# Altium schematic sheet Page1.SchDoc
size A3; SheetNumber: 1
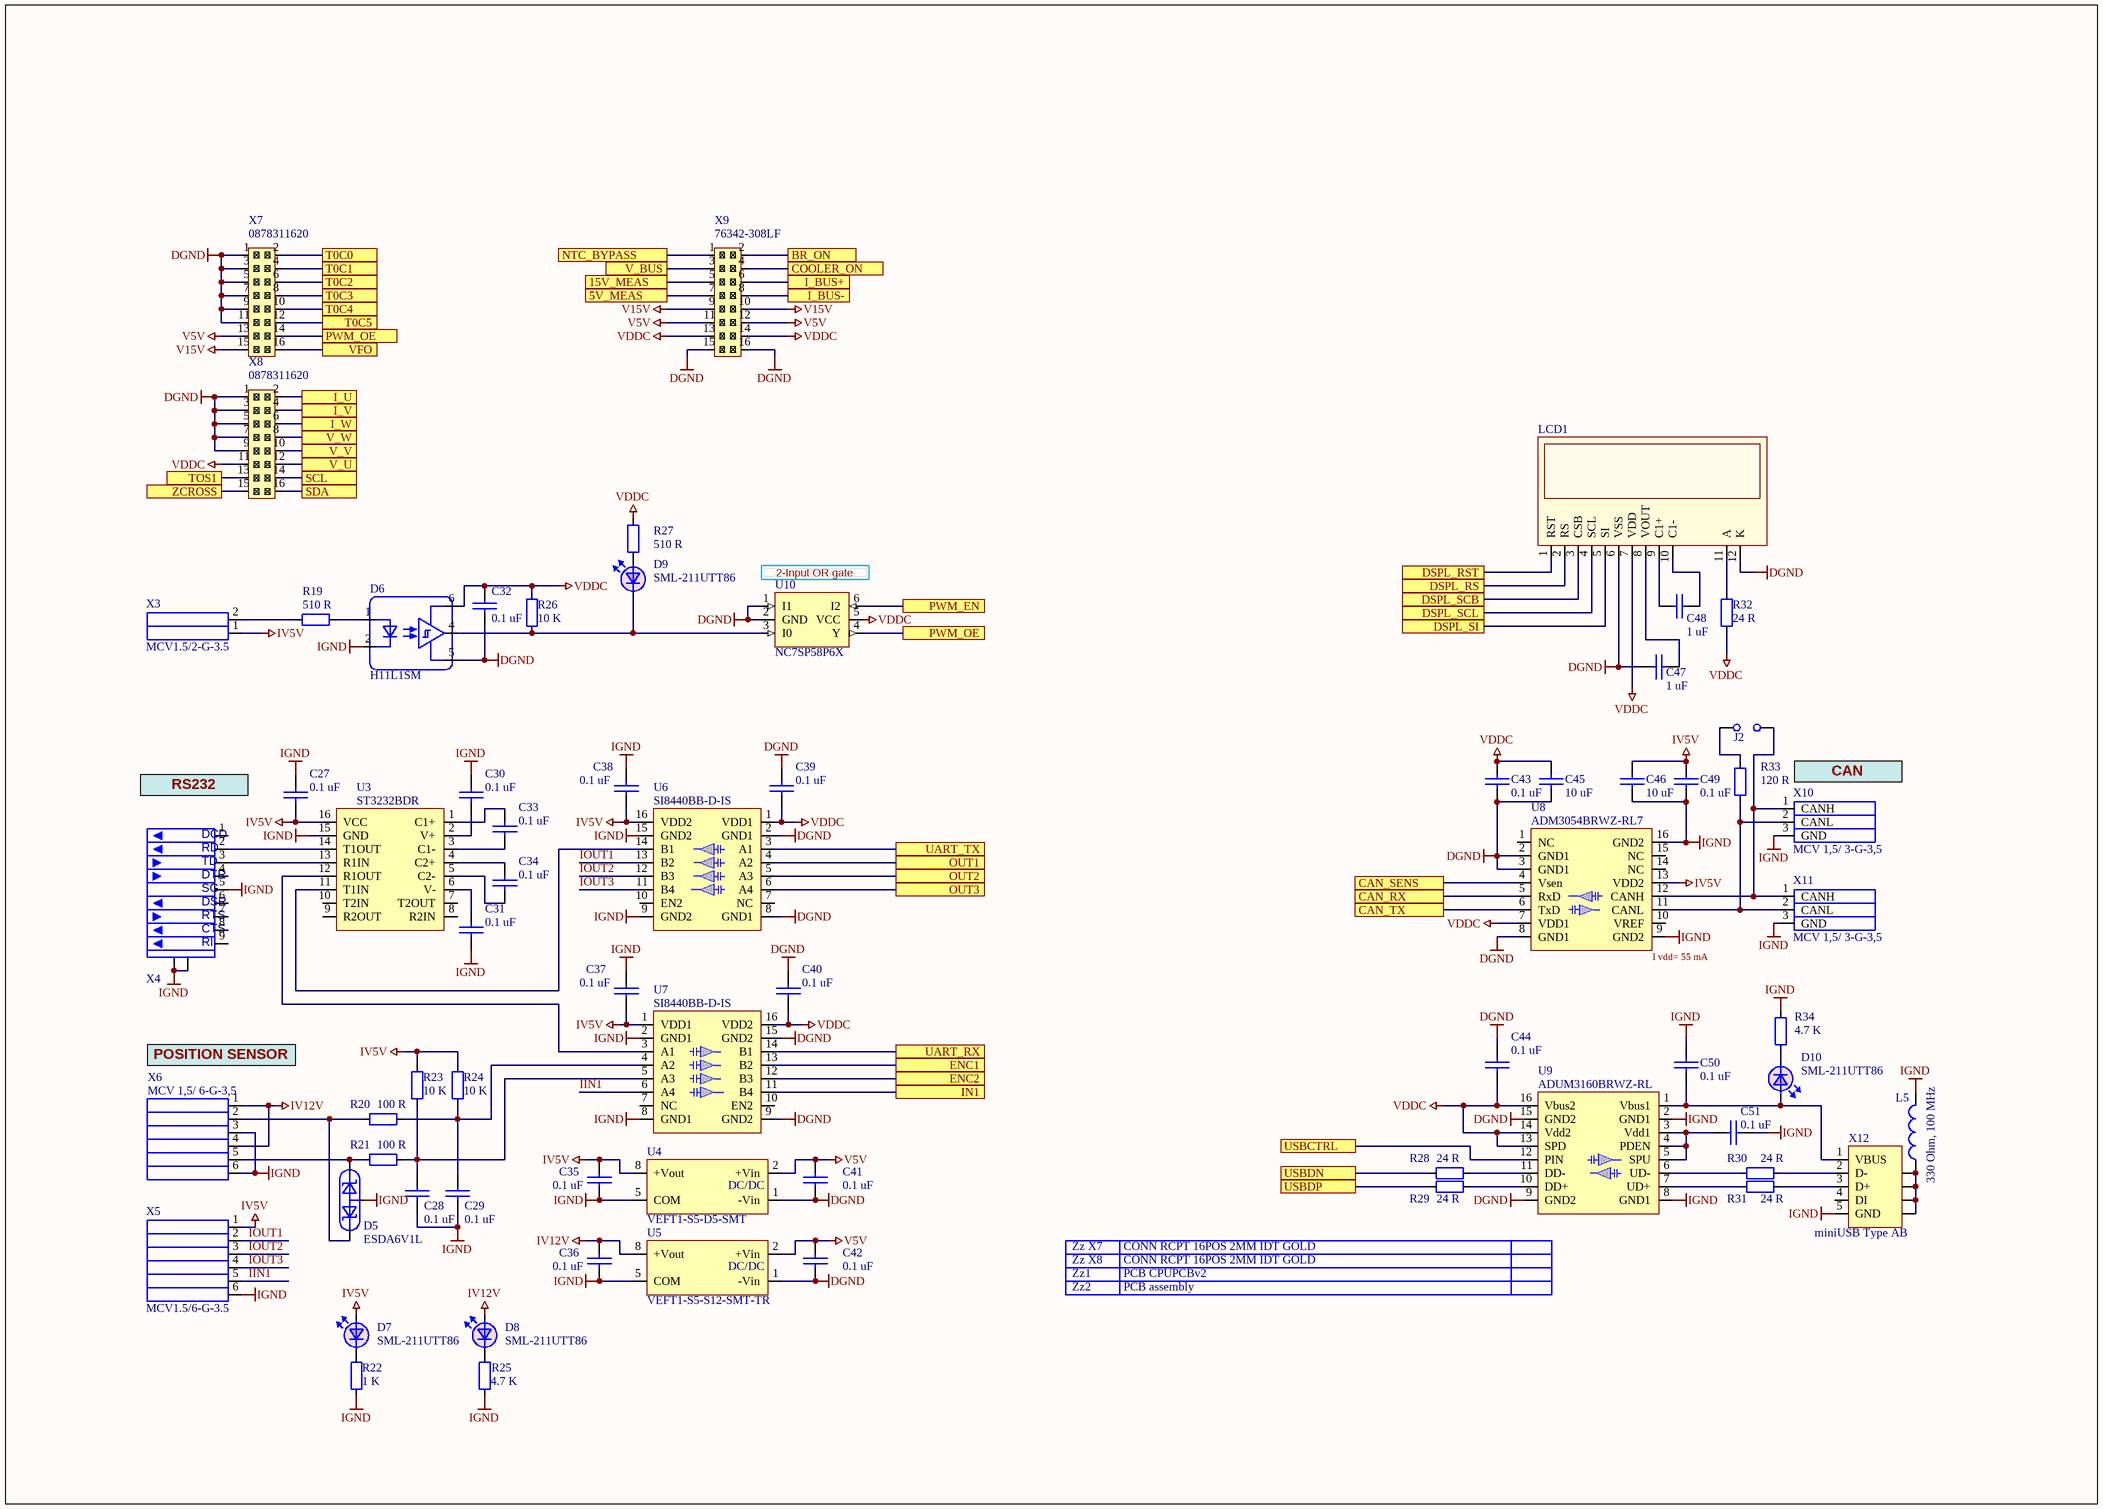
[diagram p0: Page1.SchDoc]

## Parts
C27  value 0.1 uF  [1608[0603]]  (hidden comment: CL10B104KA8NNND)
C28  value 0.1 uF  [1608[0603]]  (hidden comment: CL10B104KA8NNND)
C29  value 0.1 uF  [1608[0603]]  (hidden comment: CL10B104KA8NNND)
C30  value 0.1 uF  [1608[0603]]  (hidden comment: CL10B104KA8NNND)
C31  value 0.1 uF  [1608[0603]]  (hidden comment: CL10B104KA8NNND)
C32  value 0.1 uF  [1608[0603]]  (hidden comment: CL10B104KA8NNND)
C33  value 0.1 uF  [1608[0603]]  (hidden comment: CL10B104KA8NNND)
C34  value 0.1 uF  [1608[0603]]  (hidden comment: CL10B104KA8NNND)
C35  value 0.1 uF  [1608[0603]]  (hidden comment: CL10B104KA8NNND)
C36  value 0.1 uF  [1608[0603]]  (hidden comment: CL10B104KA8NNND)
C37  value 0.1 uF  [1608[0603]]  (hidden comment: CL10B104KA8NNND)
C38  value 0.1 uF  [1608[0603]]  (hidden comment: CL10B104KA8NNND)
C39  value 0.1 uF  [1608[0603]]  (hidden comment: CL10B104KA8NNND)
C40  value 0.1 uF  [1608[0603]]  (hidden comment: CL10B104KA8NNND)
C41  value 0.1 uF  [1608[0603]]  (hidden comment: CL10B104KA8NNND)
C42  value 0.1 uF  [1608[0603]]  (hidden comment: CL10B104KA8NNND)
C43  value 0.1 uF  [1608[0603]]  (hidden comment: CL10B104KA8NNND)
C44  value 0.1 uF  [1608[0603]]  (hidden comment: CL10B104KA8NNND)
C45  value 10 uF  [2012[0805]]  (hidden comment: C2012X5R1C106K085AC)
C46  value 10 uF  [2012[0805]]  (hidden comment: C2012X5R1C106K085AC)
C47  value 1 uF  [2012[0805]]  (hidden comment: CVUF001K0805)
C48  value 1 uF  [2012[0805]]  (hidden comment: CVUF001K0805)
C49  value 0.1 uF  [1608[0603]]  (hidden comment: CL10B104KA8NNND)
C50  value 0.1 uF  [1608[0603]]  (hidden comment: CL10B104KA8NNND)
C51  value 0.1 uF  [1608[0603]]  (hidden comment: CL10B104KA8NNND)
D5  ESDA6V1L  [SOT23]
D6  H11L1SM  [DIP-6 SMD]
D7  SML-211UTT86  [0805 LED]
D8  SML-211UTT86  [0805 LED]
D9  SML-211UTT86  [0805 LED]
D10  SML-211UTT86  [0805 LED]
J2  PH1-02-TA-HT  [HDR1X2V]  (value not drawn)
L5  value 330 Ohm, 100 MHz  [0603]  (hidden comment: BLM18SG331TN1D)
LCD1  NHD-C0216CZ-FSW-FBW-3V3  [Display NHD-C0216CZ-FSW-FBW-3V3]  (value not drawn)
R19  value 510 R  [0603]  (hidden comment: CRCW0603510RFKEA)
R20  value 100 R  [0603]  (hidden comment: ERJ-3EKF1000V)
R21  value 100 R  [0603]  (hidden comment: ERJ-3EKF1000V)
R22  value 1 K  [0603]  (hidden comment: RC0603FR-071KL)
R23  value 10 K  [0603]  (hidden comment: ERJ-3EKF1002V)
R24  value 10 K  [0603]  (hidden comment: ERJ-3EKF1002V)
R25  value 4.7 K  [0603]  (hidden comment: RJ0603FRE074K7L)
R26  value 10 K  [0603]  (hidden comment: ERJ-3EKF1002V)
R27  value 510 R  [0603]  (hidden comment: CRCW0603510RFKEA)
R28  value 24 R  [0603]  (hidden comment: RC0603FR-0724RL)
R29  value 24 R  [0603]  (hidden comment: RC0603FR-0724RL)
R30  value 24 R  [0603]  (hidden comment: RC0603FR-0724RL)
R31  value 24 R  [0603]  (hidden comment: RC0603FR-0724RL)
R32  value 24 R  [0603]  (hidden comment: RC0603FR-0724RL)
R33  value 120 R  [0603]  (hidden comment: CRCW0603120RFKEA)
R34  value 4.7 K  [0603]  (hidden comment: RJ0603FRE074K7L)
U3  ST3232BDR  [R-16N, AnalogDev SO-16]
U4  VEFT1-S5-D5-SMT  [VEFT1_Sx_Dx_SMT]
U5  VEFT1-S5-S12-SMT-TR  [VEFT1_Sx_Dx_SMT]
U6  SI8440BB-D-IS  [SO-G16/D10.4]
U7  SI8440BB-D-IS  [SO-G16/D10.4]
U8  ADM3054BRWZ-RL7  [SO-G16/D10.4]
U9  ADUM3160BRWZ-RL  [SO-G16/D10.4]
U10  NC7SP58P6X  [SOT363]
X3  MCV1.5/2-G-3.5  [mcv1.5-2-g_3.5]
X4  DB9V_1-1634222-2  [DB9 vertical]  (value not drawn)
X5  MCV1.5/6-G-3.5  [mcv1.5-6-g_3.5]
X6  MCV 1,5/ 6-G-3,5  [mcv1.5-6-g_3.5]
X7  0878311620  [8x2, 2.00mm Pitch Milli-Grid™ Header, Molex]
X8  0878311620  [8x2, 2.00mm Pitch Milli-Grid™ Header, Molex]
X9  76342-308LF  [76342-308LF]
X10  MCV 1,5/ 3-G-3,5  [mcv1.5-3-g_3.5]
X11  MCV 1,5/ 3-G-3,5  [mcv1.5-3-g_3.5]
X12  miniUSB Type AB  [USB AB 56579-0576 Molex]
Zz1  PCB CPUPCBv2
Zz2  PCB assembly
Zz_X7  CONN RCPT 16POS 2MM IDT GOLD
Zz_X8  CONN RCPT 16POS 2MM IDT GOLD

## Ports
5V_MEAS, 15V_MEAS, BR_ON, CAN_RX, CAN_SENS, CAN_TX, COOLER_ON, DSPL_RS, DSPL_RST, DSPL_SCB, DSPL_SCL, DSPL_SI, ENC1, ENC2, I_BUS+, I_BUS-, I_U, I_V, I_W, IN1, NTC_BYPASS, OUT1, OUT2, OUT3, PWM_EN, PWM_OE, SCL, SDA, T0C0, T0C1, T0C2, T0C3, T0C4, T0C5, TOS1, UART_RX, UART_TX, USBCTRL, USBDN, USBDP, V_BUS, V_U, V_V, V_W, VFO, ZCROSS

## Nets
DGND: C32.1 C39.2 C40.2 C41.1 C42.1 C43.1 C44.2 C45.2 C47.1 D6.5(GND) LCD1.6(VSS) LCD1.12(K) U4.1(-Vin) U5.1(-Vin) U6.2(GND1) U6.8(GND1) U7.9(GND2) U7.15(GND2) U8.2(GND1) U8.3(GND1) U8.8(GND1) U9.9(GND2) U9.15(GND2) U10.1(I1) U10.2(GND) X7.1 X7.3 X7.5 X7.7 X7.9 X7.11 X8.1 X8.3 X8.5 X8.7 X8.9 X9.15 X9.16
IGND: C27.2 C28.1 C29.1 C30.2 C31.1 C35.1 C36.1 C37.2 C38.2 C46.2 C49.1 C50.2 C51.2 D5.3 D6.2(C) L5.1 R22.1 R25.1 R34.1 U3.15(GND) U4.5(COM) U5.5(COM) U6.9(GND2) U6.15(GND2) U7.2(GND1) U7.8(GND1) U8.9(GND2) U8.16(GND2) U9.2(GND1) U9.8(GND1) X4.5 X4.10 X4.11 X5.6 X6.3 X6.6 X10.3(GND) X11.3(GND) X12.5(GND)
IV5V: C27.1 C35.2 C37.1 C38.1 C46.1 C49.2 D7.1 R23.1 R24.1 U3.16(VCC) U4.8(+Vout) U6.16(VDD2) U7.1(VDD1) U8.13(VDD2) X3.1 X5.1
IV12V: C36.2 D8.1 U5.8(+Vout) X6.1 X6.4
V5V: C41.2 C42.2 U4.2(+Vin) U5.2(+Vin) X7.13 X9.11 X9.12
V15V: X7.15 X9.9 X9.10
VDDC: C32.2 C39.1 C40.1 C43.2 C44.1 C45.1 D6.6(VCC) LCD1.7(VDD) R26.1 R27.1 R32.2 U6.1(VDD1) U7.16(VDD2) U8.7(VDD1) U9.13(SPD) U9.14(Vdd2) U9.16(Vbus2) U10.5(VCC) X8.11 X9.13 X9.14
5V_MEAS: X9.7 ; port 5V_MEAS
15V_MEAS: X9.5 ; port 15V_MEAS
BR_ON: X9.2 ; port BR_ON
CAN_RX: U8.5(RxD) ; port CAN_RX
CAN_SENS: U8.4(Vsen) ; port CAN_SENS
CAN_TX: U8.6(TxD) ; port CAN_TX
COOLER_ON: X9.4 ; port COOLER_ON
DSPL_RS: LCD1.2(RS) ; port DSPL_RS
DSPL_RST: LCD1.1(RST) ; port DSPL_RST
DSPL_SCB: LCD1.3(CSB) ; port DSPL_SCB
DSPL_SCL: LCD1.4(SCL) ; port DSPL_SCL
DSPL_SI: LCD1.5(SI) ; port DSPL_SI
ENC1: U7.13(B2) ; port ENC1
ENC2: U7.12(B3) ; port ENC2
I_BUS+: X9.6 ; port I_BUS+
I_BUS-: X9.8 ; port I_BUS-
I_U: X8.2 ; port I_U
I_V: X8.4 ; port I_V
I_W: X8.6 ; port I_W
IIN1: U7.6(A4) X5.5
IN1: U7.11(B4) ; port IN1
IOUT1: U6.13(B2) X5.2
IOUT2: U6.12(B3) X5.3
IOUT3: U6.11(B4) X5.4
NTC_BYPASS: X9.1 ; port NTC_BYPASS
OUT1: U6.4(A2) ; port OUT1
OUT2: U6.5(A3) ; port OUT2
OUT3: U6.6(A4) ; port OUT3
PWM_EN: U10.6(I2) ; port PWM_EN
PWM_OE: U10.4(Y) X7.14 ; port PWM_OE
SCL: X8.14 ; port SCL
SDA: X8.16 ; port SDA
T0C0: X7.2 ; port T0C0
T0C1: X7.4 ; port T0C1
T0C2: X7.6 ; port T0C2
T0C3: X7.8 ; port T0C3
T0C4: X7.10 ; port T0C4
T0C5: X7.12 ; port T0C5
TOS1: X8.13 ; port TOS1
UART_RX: U7.14(B1) ; port UART_RX
UART_TX: U6.3(A1) ; port UART_TX
USBCTRL: U9.12(PIN) ; port USBCTRL
USBDN: R28.2 ; port USBDN
USBDP: R29.1 ; port USBDP
V_BUS: X9.3 ; port V_BUS
V_U: X8.12 ; port V_U
V_V: X8.10 ; port V_V
V_W: X8.8 ; port V_W
VFO: X7.16 ; port VFO
ZCROSS: X8.15 ; port ZCROSS
NetC28_2: C28.2 R21.1 R23.2 U7.5(A3)
NetC29_2: C29.2 R20.1 R24.2 U7.4(A2)
NetC30_1: C30.1 U3.2(V+)
NetC31_2: C31.2 U3.6(V-)
NetC33_1: C33.1 U3.3(C1-)
NetC33_2: C33.2 U3.1(C1+)
NetC34_1: C34.1 U3.5(C2-)
NetC34_2: C34.2 U3.4(C2+)
NetC47_2: C47.2 LCD1.8(VOUT)
NetC48_1: C48.1 LCD1.9(C1+)
NetC48_2: C48.2 LCD1.10(C1-)
NetC50_1: C50.1 D10.1 U9.1(Vbus1) X12.1(VBUS)
NetC51_1: C51.1 U9.3(Vdd1) U9.4(PDEN) U9.5(SPU)
NetD5_1: D5.1 R21.2 X6.5
NetD5_2: D5.2 R20.2 X6.2
NetD6_1: D6.1(A) R19.1
NetD6_4: D6.4(OUT) D9.2 R26.2 U10.3(I0)
NetD7_2: D7.2 R22.2
NetD8_2: D8.2 R25.2
NetD9_1: D9.1 R27.2
NetD10_2: D10.2 R34.2
NetJ2_1: J2.1 U8.12(CANH) X10.1(CANH) X11.1(CANH)
NetJ2_2: J2.2 R33.1
NetL5_2: L5.2 X12.S1(SHLD) X12.S2(SHLD) X12.S3(SHLD) X12.S4(SHLD)
NetLCD1_11: LCD1.11(A) R32.1
NetR19_2: R19.2 X3.2
NetR28_1: R28.1 U9.11(DD-)
NetR29_2: R29.2 U9.10(DD+)
NetR30_1: R30.1 X12.2(D-)
NetR30_2: R30.2 U9.6(UD-)
NetR31_1: R31.1 U9.7(UD+)
NetR31_2: R31.2 X12.3(D+)
NetR33_2: R33.2 U8.11(CANL) X10.2(CANL) X11.2(CANL)
NetU3_11: U3.11(T1IN) U6.14(B1)
NetU3_12: U3.12(R1OUT) U7.3(A1)
NetU3_13: U3.13(R1IN) X4.3
NetU3_14: U3.14(T1OUT) X4.2

Not connected (* = marked no-connect by the designer): U3 7(T2OUT) 8(R2IN) 9(R2OUT) 10(T2IN); U6 7(NC) 10(EN2); U7 7(NC) 10(EN2); U8 1(NC) 10(VREF) 14(NC) 15(NC); X4 1 4 6 7 8 9; X12 4(DI)

## Notes on the sheet
- (near U10) 2-Input OR gate
- (near X10) CAN
- RS232
- (near U8) I vdd= 55 mA
- (near X6) POSITION SENSOR
- (in symbol DB9V_1-1634222-2) DCD; RD; TD; DTR; SG; DSR; RTS; CTS; RI
- (in symbol VEFT1-S5-D5-SMT) DC/DC
- (in symbol VEFT1-S5-S12-SMT-TR) DC/DC

## Library data of the parts
C27-C44 C49-C51 = CVNF100K0603-25: 0.1 uF, 25V, 10% , X7R,  0603 SMD MLC Capacitor; Manufacturer: SAMSUNG; Tolerance: 10%; Distributor: Future; Price: 0.0026 Euro; Voltage: 25 V; PartNum: CL10B104KA8NNND; PartName: CL10B104KA8NNND; Price50: 0.0026 Euro; Price100: 0.0026 Euro; Price1000: 0.0026 Euro
C45 C46 = C2012X5R1C106K/0.85: 10 uF, 16V, X5R, ±10%, 0805; Manufacturer: TDK Corporation; Distributor: Future; Price: 0.0347 Euro; Tolerance: ±10%; PartNum: C2012X5R1C106K085AC; Voltage: 16V; PartName: C2012X5R1C106K085AC; Price50: 0.0347 Euro; Price100: 0.0347 Euro; Price1000: 0.0347 Euro
C47 C48 = CVUF001K0805: 1 uF, 16V, 10%, X7R, 0805; Manufacturer: Kemet, Rohm, Darfon; Tolerance: 10%; Price: 0.023 Euro; Distributor: Schukat; PartNum: CVUF001K0805; Voltage: 16 V
D5 = ESDA6V1L: Dual transil array for ESD, 6.1 V, 300 W; Manufacturer: Micro Commercial Co; PartNum: ESDA6V1L-TPCT-ND; PartName: ESDA6V1L-TP; Distributor: Digi-Key; Price: 0.23$
D6 = H11L1SM: Optocoupler, SMD, 7500V,  1 Mbit, 1.6 mA; Manufacturer: Fairchild Optoelectronics Group; PartNum: H11L1SM-ND; Price: 1.12$; Distributor: Digi-Key; PartName: H11L1SM
D7-D10 = SML-211UTT86: 0805 red LED, hibright, 2 mA, 1.8V, 130°; Manufacturer: Rohm; PartNum: 511-1292-1-ND; Ordered: Digi-Key; Distributor: Digi-Key; Price: 0.57$; Value: Red; PartName: SML-211UTT86; Price50: 0.39$; Price100: 0.34$; Price1000: 0.2$
J2 = Jumper: 2 Pos. 2.54 mm Single Row Through Hole Straight Pin Header; Manufacturer: ADAM TECH; Distributor: Future; Price: 0.02 Euro; PartNum: PH1-02-TA-HT; PartName: PH1-02-TA-HT; Price50: 0.02 Euro; Price100: 0.02 Euro; Price1000: 0.02 Euro
L5 = BLM18SG331TN1D: Ferrite bead, 330 Ohm, 100 MHz,  1.5 A, 0.07 Ohm; Manufacturer: Murata Electronics North America; Tolerance: 25%; Distributor: Future; Price: 0.03 Euro; PartNum: BLM18SG331TN1D; PartName: BLM18SG331TN1D; Price50: 0.03 Euro; Price100: 0.03 Euro; Price1000: 0.03 Euro
LCD1 = NHD-C0216CZ-FSW-FBW-3V3: LCD COG CHAR 2X16 WHT TRANSFL; Manufacturer: Newhaven Display Intl; PartNum: NHD-C0216CZ-FSW-FBW-3V3-ND; Distributor: Digi-Key; Price: 11$; PartName: NHD-C0216CZ-FSW-FBW-3V3
R19 R27 = RL0603E510-1: 510 R, 1%, 0603, SMD Resistor, Taped; Manufacturer: Vishay; Voltage: 75 V; Distributor: Future; Price: 0.002 Euro; Tolerance: 1%; PartNum: CRCW0603510RFKEA; PartName: CRCW0603510RFKEA
R20 R21 = RL0603E100-1_1: 100 R, 1%, 0603, SMD Resistor, Taped; Manufacturer: PANASONIC; Voltage: 75 V; Distributor: Future; Price: 0.0017$; Tolerance: 1%; PartNum: ERJ-3EKF1000V; PartName: ERJ-3EKF1000V; Price50: 0.0015 Euro; Price100: 0.0015 Euro; Price1000: 0.0015 Euro
R22 = RL0603K001-1_1: 1 K, 1%, 0603, SMD Resistor, Taped; Manufacturer: YAGEO AMERICA CORPORATION; Voltage: 75 V; Distributor: Future; Price: 0.0017$; Tolerance: 1%; PartNum: RC0603FR-071KL; PartName: RC0603FR-071KL; Price50: 0.0017$; Price100: 0.0017$; Price1000: 0.0017$
R23 R24 R26 = RL0603K010-1: 10 K, 1%, 0603, SMD Resistor, Taped; Manufacturer: PANASONIC; Voltage: 75 V; Distributor: Future; Price: 0.0015 Euro; Tolerance: 1%; PartNum: ERJ-3EKF1002V; PartName: ERJ-3EKF1002V; Price50: 0.0015 Euro; Price100: 0.0015 Euro; Price1000: 0.0015 Euro
R25 R34 = RL0603K004.7-1_1: 4.7 K, 1%, 0603, SMD Resistor, Taped; Manufacturer: YAGEO AMERICA CORPORATION; Voltage: 75 V; Distributor: Future; Price: 0.0017$; Tolerance: 1%; PartNum: RJ0603FRE074K7L; PartName: RJ0603FRE074K7L; Price50: 0.0017$; Price100: 0.0017$; Price1000: 0.0017$
R28-R32 = RL0603E024-1_1: 24 R, 1%, 0603, SMD Resistor, Taped; Manufacturer: YAGEO AMERICA CORPORATION; Voltage: 75 V; Distributor: Future; Price: 0.0017$; Tolerance: 1%; PartNum: RC0603FR-0724RL; PartName: RC0603FR-0724RL; Price50: 0.0017$; Price100: 0.0017$; Price1000: 0.0017$
R33 = RL0603E120-1: 120 R, 1%, 0603, SMD Resistor, Taped; Manufacturer: Vishay; Voltage: 75 V; Distributor: Future; Price: 0.002 Euro; Tolerance: 1%; PartNum: CRCW0603120RFKEA; PartName: CRCW0603120RFKEA
U3 = ST3232BDR: Low Power, 3.3 V, RS-232 Line Drivers/Receivers, 16-pin TSSOP16; Manufacturer: ST; Price: 1.95 $; Distributor: Mouser; PartNum: ST3232BDR; PartName: ST3232BDR
U4 = VEFT1-S5-D5-SMT: DC/DC 5V In 5V Out,  1W, -40..+85 C, 3KV; Manufacturer: CUI Inc; PartNum: 102-2123-1-ND; Price: 6.59$; Distributor: Digi-Key; PartName: VEFT1-S5-D5-SMT
U5 = VEFT1-S5-S12-SMT-TR: DC/DC 5V In 12V Out,  1W, -40..+85 C, 3KV; Manufacturer: CUI Inc; PartNum: 102-2132-1-ND; Price: 6.59$; Distributor: Digi-Key; PartName: VEFT1-S5-S12-SMT-TR
U6 U7 = SI8440AB-D-IS: IC ISOLATOR 4CH 5.5V 16-SOIC; Manufacturer: Silicon Laboratories Inc; PartNum: 336-1760-5-ND; Distributor: Digi-Key; Price: 2.5$; PartName: SI8440BB-D-IS
U8 = ADM3054BRWZ-RL7: IC Isol TXRX CAN HS 16SOIC; Manufacturer: Analog Divices; PartNum: ADM3054BRWZ-RL7CT-ND; Distributor: Digi-Key; Price: 5.57$; PartName: ADM3054BRWZ-RL7
U9 = ADUM3160BRWZ-RL: IC Isol USB 2.5K 16SOIC; Manufacturer: Analog Divices; PartNum: ADUM3160BRWZ-RLCT-ND; Distributor: Digi-Key; Price: 5.57$; PartName: ADUM3160BRWZ-RL
U10 = NC7SP58P6X: IC GATE ULP UNIV 2-INP SOT363; Manufacturer: TEXAS INSTRUMENTS; PartNum: NC7SP58P6XCT-ND; Distributor: Digi-Key; Price: 0.29$; PartName: NC7SP58P6X
X3 = MCV1.5/2-G-3.5: HEADER, VERTICAL, 3.5MM, 2WAY; Manufacturer: PHOENIX CONTACT; PartNum: 3704816; PartName: 1843606; Distributor: Farnell; Price: 0.31 Euro
X4 = DB9V_1-1634222-2: AMP - 1-1634222-2 - SOCKET, D, PCB, THR/INSERT, 9WAY; Manufacturer: TYCO ELECTRONICS / AMP; PartNum: 5082018; Distributor: Farnell; Price: 1.06 Euro; PartName: DB9V_1-1634222-2
X5 = MCV1.5/6-G-3.5: HEADER, VERTICAL, 3.5MM, 6WAY; Manufacturer: PHOENIX CONTACT; PartNum: 3704853; PartName: 1843648; Distributor: Farnell; Price: 2.51
X6 = MCV1.5/6-G-3.5: HEADER, VERTICAL, 3.5MM, 6WAY; Manufacturer: PHOENIX CONTACT; PartNum: 1843648; Distributor: Phoenix Contact; Price: 0.66 Euro; PartName: MCV 1,5/ 6-G-3,5
X7 X8 = 0878311620: CONN HEADER 16POS 2MM VERT GOLD; Manufacturer: Molex; PartNum: WM18562-ND; Distributor: Digi-Key; Price: 1.19$; PartName: 0878311620
X9 = 76342-308LF: Board to Board & Mezzanine Connectors 16P VRT DR RECEPT .76 GOLD; Manufacturer: FCI; PartNum: 649-76342-308LF; Distributor: Mouser; Price: 1.52 Euro; PartName: 76342-308LF
X10 X11 = MCV1.5/3-G-3.5: HEADER, VERTICAL, 3.5MM, 3WAY; Manufacturer: PHOENIX CONTACT; PartNum: 1843619; Distributor: Phoenix Contact; Price: 0.32 Euro; PartName: MCV 1,5/ 3-G-3,5
X12 = USB AB 56579-0576: SMD USB - OTG, miniUSB Type AB; Manufacturer: Molex/Waldom Electronics Corp; PartNum: WM17122CT-ND; Distributor: Digi-Key; Price: 2.81$; PartName: miniUSB Type AB; Price50: 2.43$; Price100: 1.83$; Price1000: 1.62$
Zz1 = BOM item: Manufacturer: Brandner; PartNum: CPUPCBv2 board; PartName: CPUPCBv2; Price: 10 Euro
Zz2 = BOM item: Manufacturer: ESEMDA; PartNum: CPUPCBv2 assembly; PartName: PCB assembly; Price: 30
Zz_X7 Zz_X8 = BOM item: Manufacturer: Molex Inc; PartName: 0875681694; PartNum: WM8606-ND; Distributor: Digi-Key; Price: 2.39$